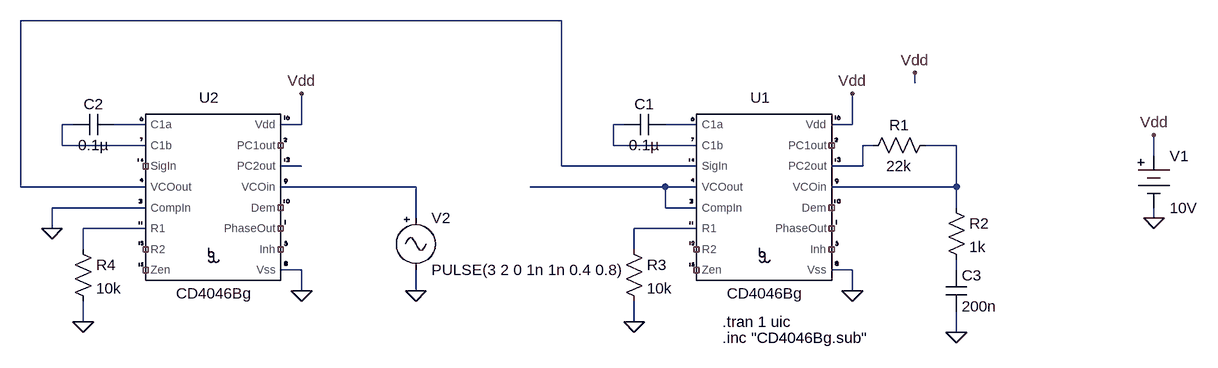
[diagram p0: schematic freq-imitation.asc]
freq-imitation.asc, the LTspice schematic file:
Version 4
SHEET 1 908 680
WIRE -96 -96 -928 -96
WIRE 448 0 448 -16
WIRE -848 64 -864 64
WIRE -736 64 -784 64
WIRE -496 64 -496 16
WIRE -496 64 -528 64
WIRE 0 64 -16 64
WIRE 112 64 64 64
WIRE 352 64 352 16
WIRE 352 64 320 64
WIRE -864 96 -864 64
WIRE -736 96 -864 96
WIRE -16 96 -16 64
WIRE 112 96 -16 96
WIRE 384 96 368 96
WIRE 512 96 464 96
WIRE 816 112 816 80
WIRE -496 128 -528 128
WIRE -96 128 -96 -96
WIRE 112 128 -96 128
WIRE 368 128 368 96
WIRE 368 128 320 128
WIRE -928 160 -928 -96
WIRE -736 160 -928 160
WIRE -320 160 -528 160
WIRE 64 160 -144 160
WIRE 112 160 64 160
WIRE 512 160 512 96
WIRE 512 160 320 160
WIRE -736 192 -880 192
WIRE 64 192 64 160
WIRE 112 192 64 192
WIRE 512 192 512 160
WIRE -320 208 -320 160
WIRE 816 208 816 192
WIRE -880 224 -880 192
WIRE -736 224 -832 224
WIRE 112 224 16 224
WIRE -832 256 -832 224
WIRE 16 256 16 224
WIRE -496 288 -528 288
WIRE 352 288 320 288
WIRE 512 288 512 272
WIRE -496 320 -496 288
WIRE -320 320 -320 288
WIRE 352 320 352 288
WIRE -832 368 -832 336
WIRE 16 368 16 336
WIRE 512 384 512 352
FLAG 816 208 0
FLAG 816 80 Vdd
FLAG 352 320 0
FLAG 352 16 Vdd
FLAG 512 384 0
FLAG 448 -16 Vdd
FLAG 16 368 0
FLAG -496 320 0
FLAG -496 16 Vdd
FLAG -832 368 0
FLAG -320 320 0
FLAG -880 224 0
SYMBOL CD4046Bg 224 208 R0
SYMATTR InstName U1
SYMBOL cap 0 80 R270
WINDOW 0 32 32 VTop 2
WINDOW 3 0 32 VBottom 2
SYMATTR InstName C1
SYMATTR Value 0.1µ
SYMBOL Misc\\battery 816 96 R0
WINDOW 123 0 0 Left 2
WINDOW 39 0 0 Left 2
SYMATTR InstName V1
SYMATTR Value 10V
SYMBOL res 0 240 R0
SYMATTR InstName R3
SYMATTR Value 10k
SYMBOL cap 496 288 R0
SYMATTR InstName C3
SYMATTR Value 200n
SYMBOL res 480 80 R90
WINDOW 0 0 56 VBottom 2
WINDOW 3 32 56 VTop 2
SYMATTR InstName R1
SYMATTR Value 22k
SYMBOL res 496 176 R0
SYMATTR InstName R2
SYMATTR Value 1k
SYMBOL CD4046Bg -624 208 R0
SYMATTR InstName U2
SYMBOL cap -848 80 R270
WINDOW 0 32 32 VTop 2
WINDOW 3 0 32 VBottom 2
SYMATTR InstName C2
SYMATTR Value 0.1µ
SYMBOL res -848 240 R0
SYMATTR InstName R4
SYMATTR Value 10k
SYMBOL Misc\\signal -320 192 R0
WINDOW 123 0 0 Left 2
WINDOW 39 0 0 Left 2
SYMATTR InstName V2
SYMATTR Value PULSE(3 2 0 1n 1n 0.4 0.8)
TEXT 152 368 Left 2 !.tran 1 uic
TEXT 152 392 Left 2 !.inc "CD4046Bg.sub"

The netlist it stands for:
* freq-imitation.asc
XU1 N005 N004 N010 NC_01 N012 NC_02 N001 N007 Vdd 0 NC_03 NC_04 N006 NC_05 N010 NC_06 CD4046Bg  ; pins C1a C1b CompIn Inh R1 R2 SigIn VCOin Vdd Vss Dem PC1out PC2out PhaseOut VCOout Zen
C1 N004 N005 0.1µ
V1 Vdd 0 10V
R3 N012 0 10k
C3 N013 0 200n
R1 N007 N006 22k
R2 N007 N013 1k
XU2 N003 N002 0 NC_07 N011 NC_08 NC_09 N009 Vdd 0 NC_10 NC_11 N008 NC_12 N001 NC_13 CD4046Bg  ; pins C1a C1b CompIn Inh R1 R2 SigIn VCOin Vdd Vss Dem PC1out PC2out PhaseOut VCOout Zen
C2 N002 N003 0.1µ
R4 N011 0 10k
V2 N009 0 PULSE(3 2 0 1n 1n 0.4 0.8)
.tran 1 uic
.inc "CD4046Bg.sub"
.backanno
.end